# Altium project TK517_P5V0-PSU.PrjPcb
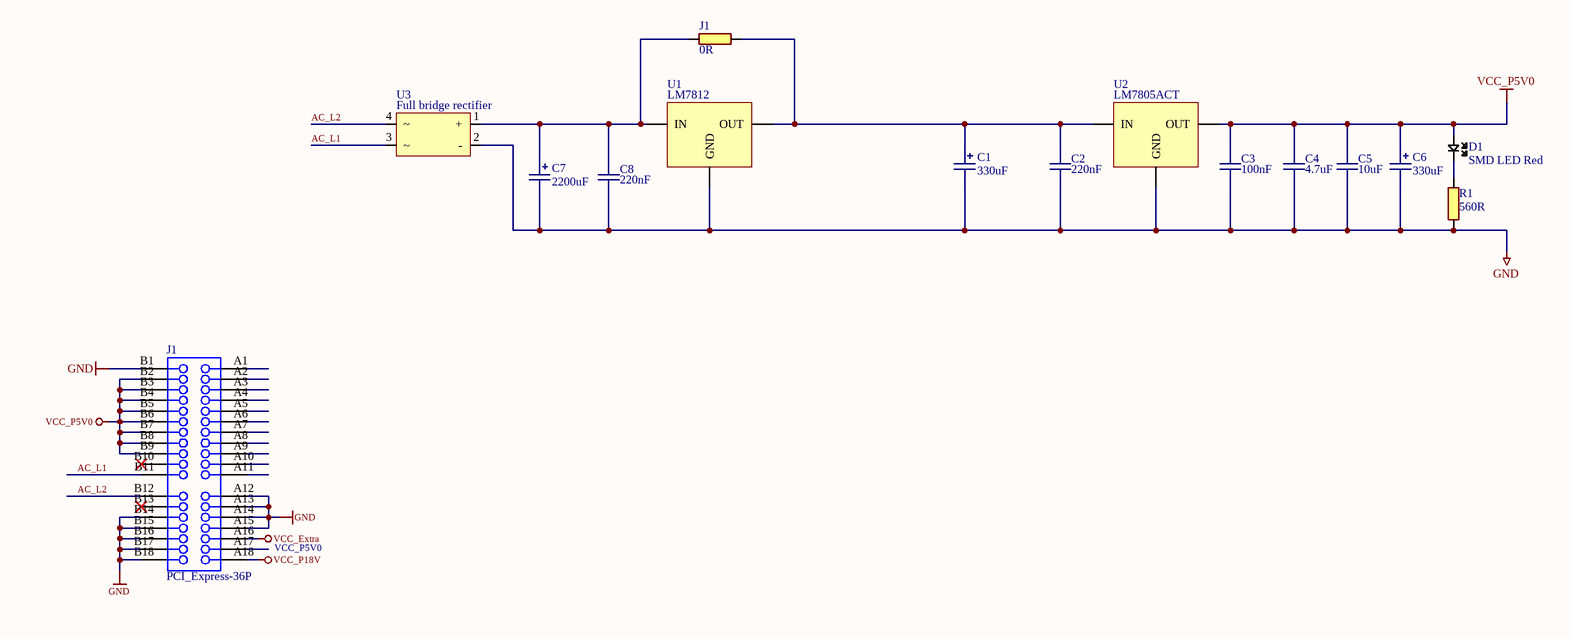
[diagram p0: TK517_P5V0-PSU.SchDoc]
1 sheet, 15 parts. Net scope: global (net labels, ports and power ports of the same name join across sheets).
Board file: TK517_P5V0-PSU.PcbDoc

## Sheet TK517_P5V0-PSU.SchDoc: TK517 P5V0-PSU
size A3; Organization: Omega Verksted; DocumentNumber: 10; Revision: 0; SheetNumber: 10; SheetTotal: 20

### Parts
(Parts that share a designator on the sheet are numbered #1, #2 ... from top to bottom, then left to right.)
C1  330uF  [CAPPR35D08H16]
C2  220nF  [CAPC0603(1608)55_N]
C3  100nF  [CAPC0603(1608)55_N]
C4  4.7uF  [CAPC0805(2012)100_N]
C5  10uF  [CAPC0805(2012)100_N]
C6  330uF  [CAPPR35D08H16]
C7  2200uF  [CAPPR35D08H16]
C8  220nF  [CAPC0603(1608)55_N]
D1  SMD LED Red  [I_LEDC0603(1608)_N]
J1#1  0R  [RESC0603(1608)_N]
J1#2  PCI_Express-36P  [PCIeX1-GF-2D-1000-1K-O36]
R1  560R  [RESC0603(1608)_N]
U1  LM7812  [TO-220-3P]
U2  LM7805ACT  [TO-220-3P]
U3  Full bridge rectifier  [SOP500P1010X260-4N]

### Nets
2: U1.4 U2.4
GND: C1.1 C2.1 C3.1 C4.1 C5.1 C6.1 C7.1 C8.1 J1#2.A12 J1#2.A13 J1#2.A14 J1#2.A15 J1#2.B1 J1#2.B14 J1#2.B15 J1#2.B16 J1#2.B17 J1#2.B18 R1.1 U1.2(GND) U2.2(GND) U3.2(-)
VCC_Extra: J1#2.A16
VCC_P5V0: C3.2 C4.2 C5.2 C6.2 D1.1 J1#2.B2 J1#2.B3 J1#2.B4 J1#2.B5 J1#2.B6 J1#2.B7 J1#2.B8 J1#2.B9 U2.3(OUT)
VCC_P18V: J1#2.A18
AC_L1: J1#2.B11 U3.3
AC_L2: J1#2.B12 U3.4
NetC1_2: C1.2 C2.2 J1#1.1 U1.3(OUT) U2.1(IN)
NetC7_2: C7.2 C8.2 J1#1.2 U1.1(IN) U3.1(+)
NetD1_2: D1.2 R1.2

Not connected (* = marked no-connect by the designer): J1#2 A1 A2 A3 A4 A5 A6 A7 A8 A9 A10 A11 A17 B10* B13*

### Notes on the sheet
- (near J1#2) VCC_P5V0
- Size:
- Date:
- Title:
- A3
- Revision:
- Sheet
- of
- Author:
- File:

### Library data of the parts
C1 C6 = 3891: 25V elektrolytt; id: 3891; pakke_opprettet_av: 1335; pakke_opprettet: 13.11.2016 14.32.40; symbol_opprettet_av: 815; symbol_opprettet: 28.06.2014 15.26.13; leverandor_varenr: 2346202; pris: 0; produsent: Rubycon; leverandor: Farnell; pakketype: TH; navn: 330uF
C2 C8 = 3934: Capacitor; id: 3934; pakke_opprettet_av: 815; pakke_opprettet: 18.02.2015 14.18.13; symbol_opprettet: 14.11.2014 20.19.34; pris: 0; nokkelord: kondensator; pakketype: 0603; symbol_opprettet_av: 815; navn: 220nF
C3 = 3028: X7R 50V 5%; id: 3028; pakke_opprettet_av: 815; pakke_opprettet: 18.02.2015 14.18.13; symbol_opprettet: 14.11.2014 20.19.34; leverandor_varenr: 1759122; pris: 1; nokkelord: Kondensator, Capacitor, CAP; produsent: Multikomp; leverandor: Farnell; pakketype: 0603; symbol_opprettet_av: 815; navn: 100nF
C4 = 4248: X5R 10V 10%; id: 4248; pakke_opprettet_av: 815; pakke_opprettet: 14.11.2014 20.52.01; symbol_opprettet: 14.11.2014 20.19.34; pris: 0; pakketype: 0805; symbol_opprettet_av: 815; navn: 4.7uF
C5 = 4046: X5R 6.3V 10%; id: 4046; pakke_opprettet_av: 815; pakke_opprettet: 14.11.2014 20.52.01; symbol_opprettet: 14.11.2014 20.19.34; leverandor_varenr: 2320852; pris: 0; leverandor: Farnell; pakketype: 0805; symbol_opprettet_av: 815; navn: 10uF
C7 = 3891: 25V elektrolytt; pakketype: TH; navn: 2200uF
D1 = 2209: id: 2209; rad: 0; rom: OV; lager_type: Fremlager; dybde: 2; hylle: 13; antall: 50; pakke_opprettet_av: 815; pakke_opprettet: 06.07.2014 18.55.44; symbol_opprettet: 06.07.2014 18.59.47; leverandor_varenr: 8554641; pris: 1; produsent: Avago; leverandor: Farnell; pakketype: 0603; kolonne: 0; symbol_opprettet_av: 815; beskrivelse: SMD; navn: SMD LED Red; nokkelord: SMD
J1#1 = 3435: 0.1W 1% Thick film resistor; navn: 0R
J1#2 = 3177: PCI express PCB kortkankonnektor; id: 3177; pakke_opprettet_av: 815; pakke_opprettet: 07.06.2015 17.49.10; symbol_opprettet: 06.07.2014 17.26.37; pris: 0; symbol_opprettet_av: 815; navn: PCIeX1-GF-2D-1000-1K-O36; pakketype: -
R1 = 3435: 0.1W 1% Thick film resistor; id: 3435; rad: -1; rom: OV; lager_type: Fremlager; dybde: 42; hylle: 6; antall: 100; kolonne: 0; pakke_opprettet_av: 815; pakke_opprettet: 08.07.2014 21.15.30; symbol_opprettet: 08.07.2014 21.16.33; pakketype: 0603; symbol_opprettet_av: 815; navn: 560R; pris: 0
U1 = 1433: Voltage Regulator 12V 1A; rad: 2; rom: OV; dybde: 0; hylle: 9; antall: 50; pakketype: TH; kolonne: 0; navn: LM7812
U2 = 1433: Voltage Regulator 5V 1A; id: 1433; rad: 0; rom: OV; lager_type: Fremlager; hylle: 9; antall: 50; pakke_opprettet_av: 815; pakke_opprettet: 09.06.2015 21.08.41; symbol_opprettet: 20.06.2015 13.45.33; leverandor_varenr: 2296047; pris: 8; produsent: Fairchild; leverandor: Farnell; pakketype: TH; dybde: 0; kolonne: 0; symbol_opprettet_av: 815; navn: LM7805ACT
U3 = DBLS07G Rectifier: farnell: 1299301